# Altium schematic sheet SPLIT2.SchDoc
size 431 x 279 mm
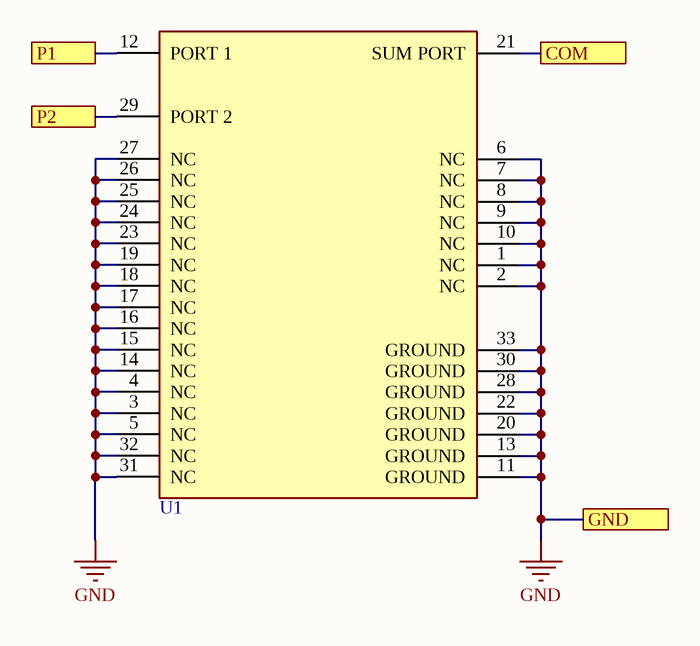
[diagram p0: SPLIT2.SchDoc]

## Parts
U1  EP2RKU+  [EP2RKU+]  (value not drawn)

## Ports
COM, GND, P1, P2

## Nets
GND: U1.1(NC) U1.2(NC) U1.3(NC) U1.4(NC) U1.5(NC) U1.6(NC) U1.7(NC) U1.8(NC) U1.9(NC) U1.10(NC) U1.11(GROUND) U1.13(GROUND) U1.14(NC) U1.15(NC) U1.16(NC) U1.17(NC) U1.18(NC) U1.19(NC) U1.20(GROUND) U1.22(GROUND) U1.23(NC) U1.24(NC) U1.25(NC) U1.26(NC) U1.27(NC) U1.28(GROUND) U1.30(GROUND) U1.31(NC) U1.32(NC) U1.33(GROUND) ; port GND
COM: U1.21(SUM_PORT) ; port COM
P1: U1.12(PORT_1) ; port P1
P2: U1.29(PORT_2) ; port P2

## Notes on the sheet
- DWG. NO.
- REV.
- SHT.
- THIS DOCUMENT AND THE DATA DISCLOSED HEREIN OR HEREWITH IS THE PROPERTY OF ALTIUM LIMITED AND MAY BE FREELY DISTRIBUTED IN WHOLE. NO RIGHTS ARE RESERVED OR EXPRESS OR IMPLIED WARANTEE GIVEN.
- REVISION
- DESCRIPTION
- DATE
- APPROVED
- ENG:
- APPROVALS
- PROJECT
- DSN:
- CHK:
- REFERENCE DOCUMENTS
- PROJECT REVISION:
- TITLE
- DOCUMENT REVISION:
- DESIGN ITEM:
- BOM:
- FAB DWG:
- PCB DWG:
- ASSY DWG:
- SCALE:
- SIZE
- B
- CAGE CODE
- FILE NAME
- DWG NO.
- SHEET
- OF
- REV

## Library data of the parts
U1 = EP2RKU+: 2 Ways MMIC Power Splitter, DC - 18000 MHz, 50Ω